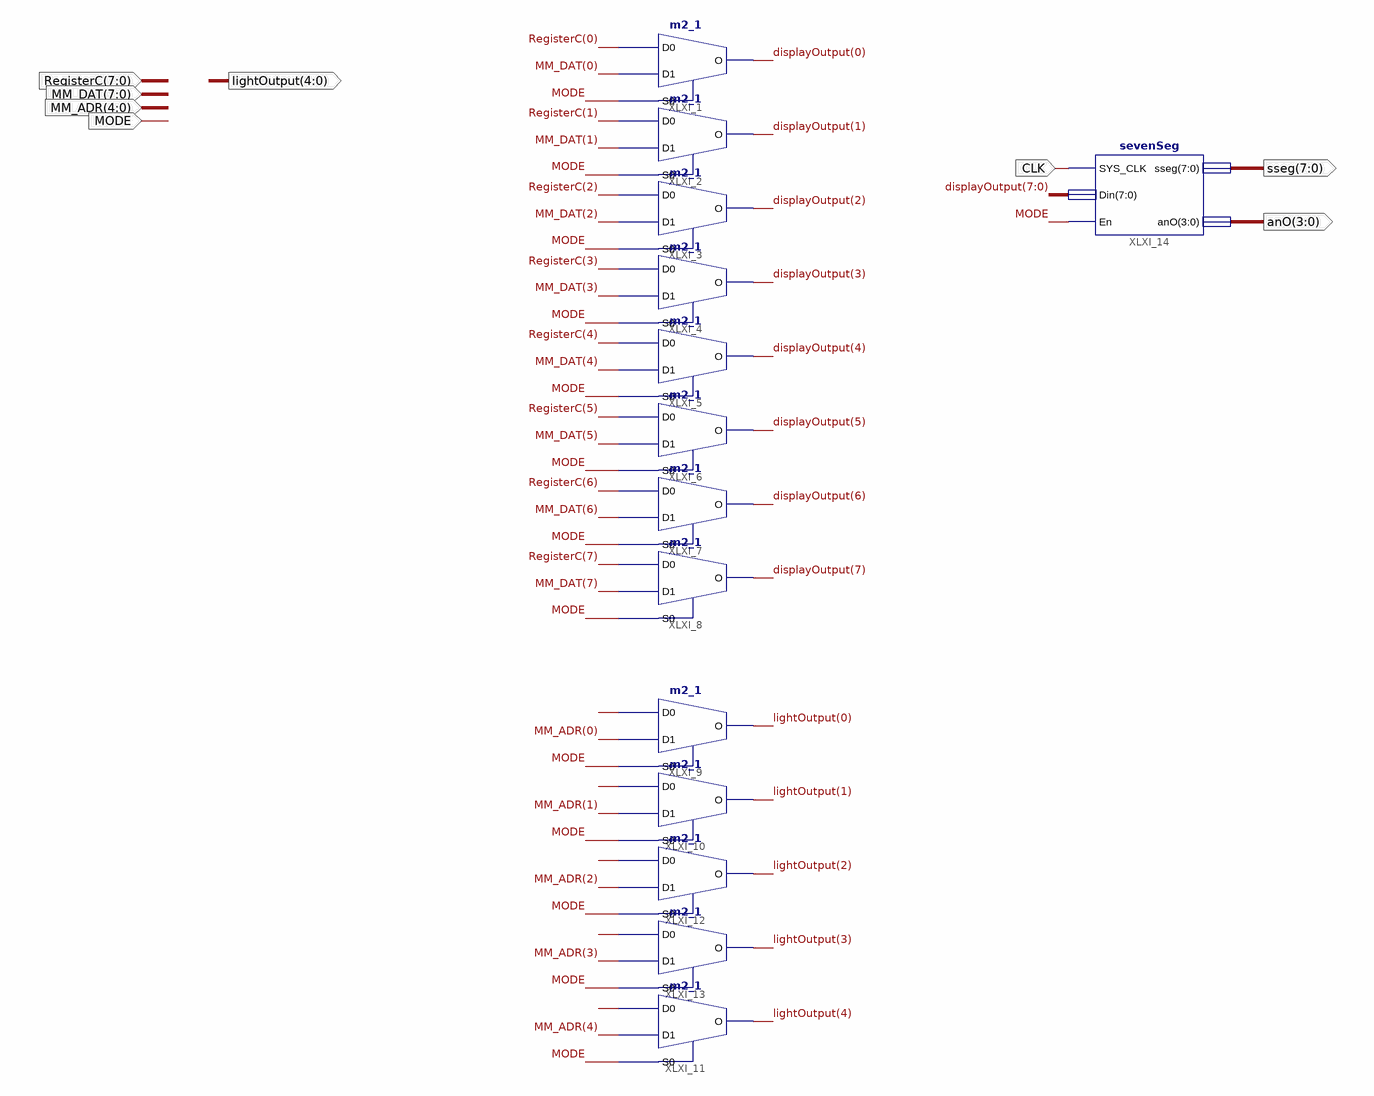
[diagram p0: schematic sheet 1]
// Xilinx ISE schematic DisplayModule.sch (spartan3e) as structural Verilog: 14 symbols, 8 ports
module DisplayModule (
  input  [7:0] RegisterC,
  input  [7:0] MM_DAT,
  input  [4:0] MM_ADR,
  input  MODE,
  input  CLK,
  output [7:0] sseg,
  output [3:0] anO,
  output [4:0] lightOutput
);

  wire XLXN_20, XLXN_35, XLXN_38, XLXN_41, XLXN_44;
  wire [7:0] displayOutput;

  m2_1 XLXI_1 (.D0(RegisterC[0]), .D1(MM_DAT[0]), .S0(MODE), .O(displayOutput[0]));
  m2_1 XLXI_2 (.D0(RegisterC[1]), .D1(MM_DAT[1]), .S0(MODE), .O(displayOutput[1]));
  m2_1 XLXI_3 (.D0(RegisterC[2]), .D1(MM_DAT[2]), .S0(MODE), .O(displayOutput[2]));
  m2_1 XLXI_4 (.D0(RegisterC[3]), .D1(MM_DAT[3]), .S0(MODE), .O(displayOutput[3]));
  m2_1 XLXI_5 (.D0(RegisterC[4]), .D1(MM_DAT[4]), .S0(MODE), .O(displayOutput[4]));
  m2_1 XLXI_6 (.D0(RegisterC[5]), .D1(MM_DAT[5]), .S0(MODE), .O(displayOutput[5]));
  m2_1 XLXI_7 (.D0(RegisterC[6]), .D1(MM_DAT[6]), .S0(MODE), .O(displayOutput[6]));
  m2_1 XLXI_8 (.D0(RegisterC[7]), .D1(MM_DAT[7]), .S0(MODE), .O(displayOutput[7]));
  m2_1 XLXI_9 (.D0(XLXN_35), .D1(MM_ADR[0]), .S0(MODE), .O(lightOutput[0]));
  m2_1 XLXI_10 (.D0(XLXN_38), .D1(MM_ADR[1]), .S0(MODE), .O(lightOutput[1]));
  m2_1 XLXI_12 (.D0(XLXN_41), .D1(MM_ADR[2]), .S0(MODE), .O(lightOutput[2]));
  m2_1 XLXI_13 (.D0(XLXN_44), .D1(MM_ADR[3]), .S0(MODE), .O(lightOutput[3]));
  m2_1 XLXI_11 (.D0(XLXN_20), .D1(MM_ADR[4]), .S0(MODE), .O(lightOutput[4]));
  sevenSeg XLXI_14 (.SYS_CLK(CLK), .Din(displayOutput), .En(MODE), .sseg(sseg), .anO(anO));
endmodule
